# EAGLE design type5comparator (EAGLE 6.5.0)
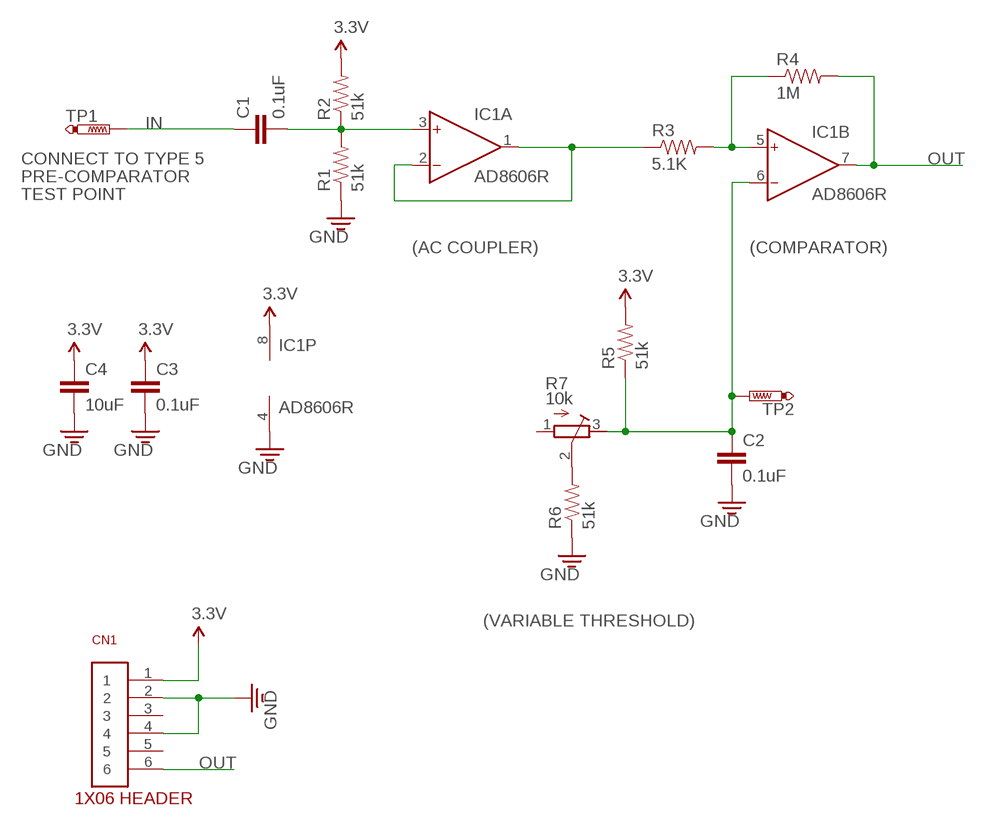
[diagram p0: schematic, sheet 1]

## Parts
C1  0.1uF  CAP0603  [0603]
C2  0.1uF  CAP0603  [0603]
C3  0.1uF  CAP0603  [0603]
C4  10uF  CAP0603  [0603]
CN1  1X06  [1X06]
IC1  AD8606R  AD8607R  [SO8]
R1  51k  RESISTOR0603  [0603]
R2  51k  RESISTOR0603  [0603]
R3  5.1K  RESISTOR0603  [0603]
R4  1M  RESISTOR0603  [0603]
R5  51k  RESISTOR0603  [0603]
R6  51k  RESISTOR0603  [0603]
R7  10k  R-TRIMM3299W  [RTRIM3299W]
TP1  PTR1PAD1-13  [P1-13]
TP2  PTR1PAD1-13  [P1-13]

## Nets
3.3V: C3.1 C4.1 CN1.1 IC1.8(P:V+) R2.2 R5.2
GND: C2.2 C3.2 C4.2 CN1.2 CN1.4 IC1.4(P:V-) R1.1 R6.1
IN: C1.1 TP1.TP
N$1: R6.2 R7.2(S)
N$2: C1.2 IC1.3(A:IN+) R1.2 R2.1
N$3: IC1.1(A:OUT) IC1.2(A:IN-) R3.1
N$4: IC1.5(B:IN+) R3.2 R4.1
N$8: C2.1 IC1.6(B:IN-) R5.1 R7.3(A) TP2.TP
OUT: CN1.6 IC1.7(B:OUT) R4.2
Unconnected: CN1.3 CN1.5 R7.1(E)

## Notes on the sheet
- CONNECT TO TYPE 5
- PRE-COMPARATOR
- TEST POINT
- (AC COUPLER) | (COMPARATOR)
- (VARIABLE THRESHOLD)

## Library data of the parts
C1-C4 = arm:CAP: Capacitor Standard 0603 ceramic capacitor, and 0.1" leaded capacitor.
CN1 = arm:1X06
IC1 = analog-devices:AD8607: Precision Micropower, Low Noise CMOS, Rail-to-Rail Input/Output Operational Amplifiers Source: http://www.analog.com/static/imported-files/data_sheets/AD8603_8607_8609.pdf; MPN: AD8607ARMZ-R2; OC_FARNELL: 1651293; OC_NEWARK: 19M8927
R1-R6 = arm:RESISTOR: Resistor Basic schematic elements and footprints for 0603, 1206, and PTH 1/10th watt (small) resistors.
R7 = resistor:R-TRIMM: Trimm resistor
TP1 TP2 = testpad:PTR1: TEST PIN

## Board
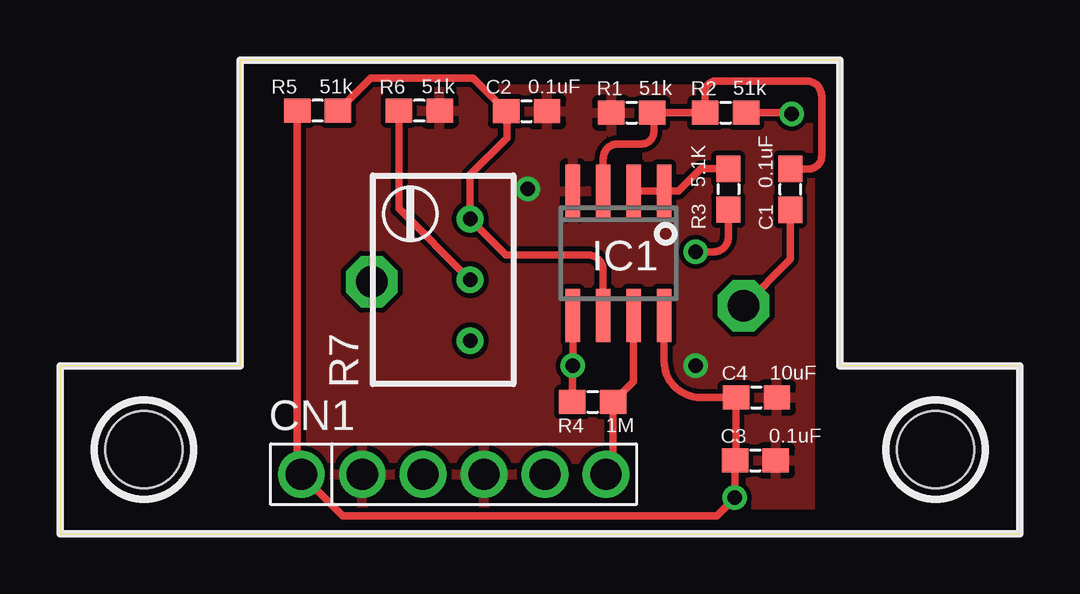
[diagram p1: board, top side]
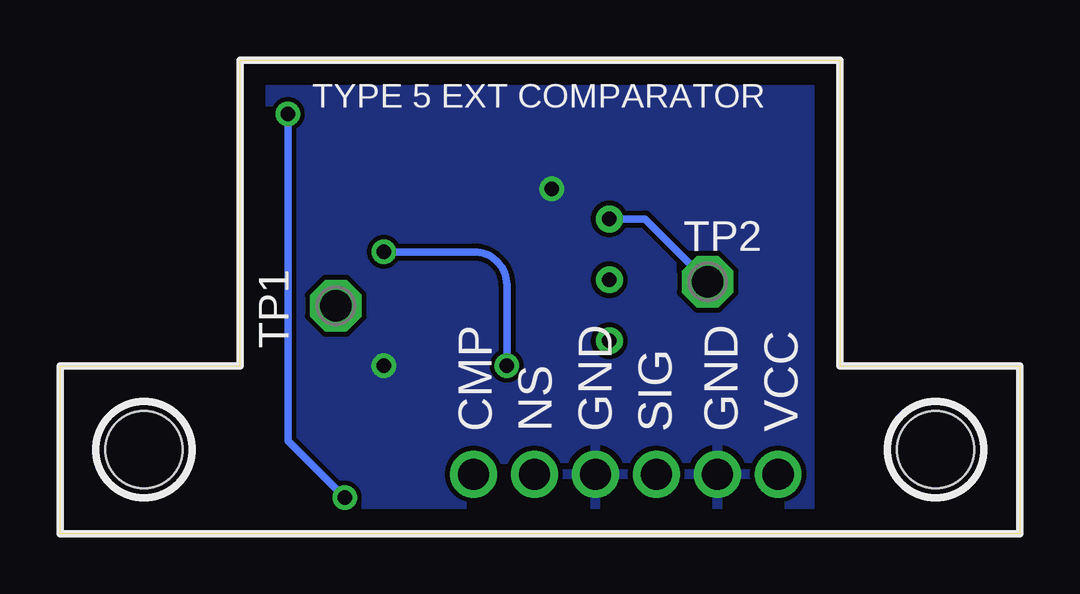
[diagram p2: board, bottom side, seen from below]

Size 40 x 19.75 mm. Coordinates in mm from the lower left corner, seen from the top.
Outline: 0,7 0,0 40,0 40,7 32.5,7 32.5,19.75 7.5,19.75 7.5,7 0,7
Copper layers (1*16): Top 0.035mm / dielectric 1.5mm / Bottom 0.035mm
Design rules "default": minimum track width 10mil, minimum drill 24mil, track to track 8mil, track to pad 8mil, pad to pad 8mil, via to via 8mil, smd to smd 8mil, copper to edge 40mil, drill to drill 8mil, minimum pad ring 10mil, minimum via ring 8mil, stop-mask expansion 4mil, vias tented up to drill 0mil, thermal gap 10mil
Holes 3.2 mm at 3.5,3.5 36.5,3.5

### Footprints (pad centres in the part's own frame; a part is rotated, then mirrored left to right if it is on the bottom)
0603 = smd 1.1 x 1: 1 -0.85,0; 2 0.85,0
1X06 = drill 1.3: 1 0,0; 2 2.54,0; 3 5.08,0; 4 7.62,0; 5 10.16,0; 6 12.7,0
SO8 = smd 0.6 x 2.2: 1 -1.905,-2.6; 2 -0.635,-2.6; 3 0.635,-2.6; 4 1.905,-2.6; 5 1.905,2.6; 6 0.635,2.6; 7 -0.635,2.6; 8 -1.905,2.6
RTRIM3299W = drill 0.61: 1 1.27,-2.54; 2 1.27,0; 3 1.27,2.54
P1-13 = drill 1.321 pad 2.159 octagon: TP 0,0

### Placement (x,y rotation side)
C1  30.45,14.36 90 top
C2  19.45,17.61 0 top
C3  28.99,3.05 0 top
C4  29.03,5.68 0 top
CN1  10.06,2.47 0 top
IC1  23.28,11.69 180 top
R1  23.83,17.55 0 top
R2  27.75,17.55 0 top
R3  27.86,14.36 270 top
R4  22.2,5.48 0 top
R5  10.74,17.64 180 top
R6  14.98,17.64 180 top
R7  15.83,10.58 0 top
TP1  28.5,9.5 180 bottom
TP2  13,10.5 0 bottom

### Tracks (layer width: path | path; a pad name or v marks a point on that pad's centre or on a via)
3.3V  (via drill 0.6)
  Top 0.305: IC1.8 25.19,7.19 arc90 26.7,5.68 C4.1 28.19,3.1 C3.1 28.14,1.52 v28.12,1.5 27.38,0.75 11.78,0.75 CN1.1 9.89,2.64 R5.2 | v30.5,17.5 30.42,17.55 R2.2
  Bottom 0.305: v28.12,1.5 30.5,3.88 v30.5,17.5
GND  (via drill 0.6)
  other vias: 19.5,14.38 26.5,7
  pour Top: 8.75,0 8.75,19.75 31.25,19.75 31.25,0
  pour Bottom: 8.75,0 8.75,19.75 31.25,19.75 31.25,0
IN
  Top 0.305: C1.1 30.45,11.45 TP1.TP
N$1
  Top 0.305: R6.2 14.13,13.55 R7.2
N$2
  Top 0.305: IC1.3 22.65,15.64 arc-90 23.25,16.25 24.25,16.25 arc90 24.75,16.75 24.75,17.48 arc90 R1.2 R2.1 arc-90 26.88,17.57 26.88,18.38 arc-90 27.38,18.88 31.12,18.88 arc-90 31.75,18.25 31.75,15.75 arc-90 31.2,15.2 C1.2
N$3
  Top 0.305: IC1.2 IC1.1 25.79,14.29 26.71,15.21 R3.1
N$4  (via drill 0.6)
  Top 0.305: R3.2 27.86,12.36 arc-90 27.25,11.75 v26.5,11.75 | IC1.5 v21.38,7 arc90 21.35,6.98 R4.1
  Bottom 0.305: v26.5,11.75 22.75,11.75 arc90 21.38,10.38 v21.38,7
N$8
  Top 0.305: R5.1 12.95,19 17.21,19 C2.1 18.62,17.59 18.62,16.5 17.1,14.98 R7.3 18.59,11.62 22,11.62 arc-90 22.65,10.98 IC1.6
  Bottom 0.305: R7.3 15.62,13.12 TP2.TP
OUT
  Top 0.305: CN1.6 23.05,2.77 R4.2 23.91,6.34 IC1.7

### Text on the board
bPlace: TYPE 5 EXT COMPARATOR | VCC | GND | SIG | GND | NS | CMP